# EAGLE design Fluffy-1A (EAGLE 7.7.0)
Assembly variants: production, production2

## Sheet 1 of 2
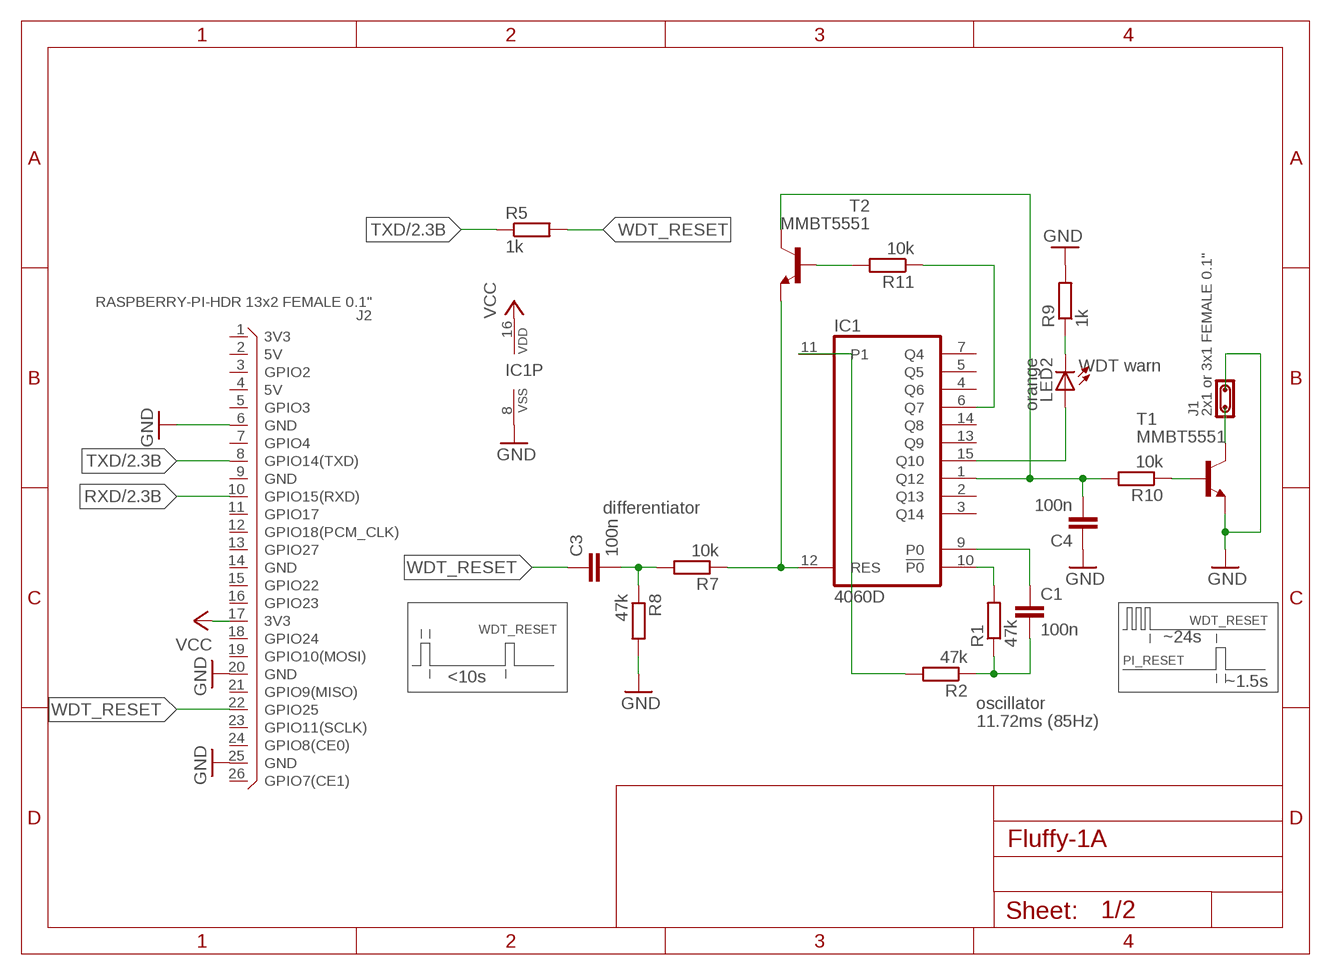
[diagram p0: schematic, sheet 1]

### Parts
C1  100n  C-EUC0805K  [C0805K]
C3  100n  C-EUC0805K  [C0805K]
C4  100n  C-EUC0805K  [C0805K]
IC1  4060D  [SO16]
J1  2x1 or 3x1 FEMALE 0.1"  JP02  [JP02N]
J2  RASPBERRY-PI-HDR 13x2 FEMALE 0.1"  RASPBERRY-PI-HDR  [X26R-DIL]
LED2  orange  LEDCHIPLED_0805  [CHIPLED_0805]
R1  47k  R-EU_R0805  [R0805]
R2  47k  R-EU_R0805  [R0805]
R5  1k  R-EU_R0805  [R0805]  (not fitted in variant production)  (not fitted in variant production2)
R7  10k  R-EU_R0805  [R0805]
R8  47k  R-EU_R0805  [R0805]
R9  1k  R-EU_R0805  [R0805]
R10  10k  R-EU_R0805  [R0805]
R11  10k  R-EU_R0805  [R0805]
T1  MMBT5551  MMBT5551LT1-NPN-SOT23-BEC  [SOT23-BEC]
T2  MMBT5551  MMBT5551LT1-NPN-SOT23-BEC  [SOT23-BEC]

### Nets
GND: C4.1 IC1.8(VSS) J1.2 J2.6(GND) J2.20(GND) J2.25(GND) R8.2 R9.2 T1.E ; also sheet 2
N$4: IC1.10(!P0) R1.2
N$5: C1.1 IC1.9(P0)
N$6: C1.2 R1.1 R2.1
N$7: LED2.C R9.1
N$9: IC1.15(Q10) LED2.A
N$10: IC1.11(P1) R2.2
N$11: C3.2 R7.2 R8.1
N$12: IC1.12(RES) R7.1 T2.E
N$15: R10.1 T1.B
N$16: J1.1 T1.C
N$17: C4.2 IC1.1(Q12) R10.2 T2.C
N$18: R11.2 T2.B
N$19: IC1.6(Q7) R11.1
RXD: J2.10(GPIO15(RXD)) ; also sheet 2
TXD: J2.8(GPIO14(TXD)) R5.1 ; also sheet 2
VCC: IC1.16(VDD) J2.17(3V3) ; also sheet 2
WDT_RESET: C3.1 J2.22(GPIO25) R5.2
Unconnected: IC1.2(Q13) IC1.3(Q14) IC1.4(Q6) IC1.5(Q5) IC1.7(Q4) IC1.13(Q9) IC1.14(Q8) J2.1(3V3) J2.2(5V) J2.3(GPIO2) J2.4(5V) J2.5(GPIO3) J2.7(GPIO4) J2.9(GND) J2.11(GPIO17) J2.12(GPIO18(PCM_CLK)) J2.13(GPIO27) J2.14(GND) J2.15(GPIO22) J2.16(GPIO23) J2.18(GPIO24) J2.19(GPIO10(MOSI)) J2.21(GPIO9(MISO)) J2.23(GPIO11(SCLK)) J2.24(GPIO8(CE0)) J2.26(GPIO7(CE1))

### Notes on the sheet
- WDT warn
- differentiator
- WDT_RESET
- WDT_RESET
- ~24s
- PI_RESET
- <10s | ~1.5s
- oscillator
- 11.72ms (85Hz)

## Sheet 2 of 2
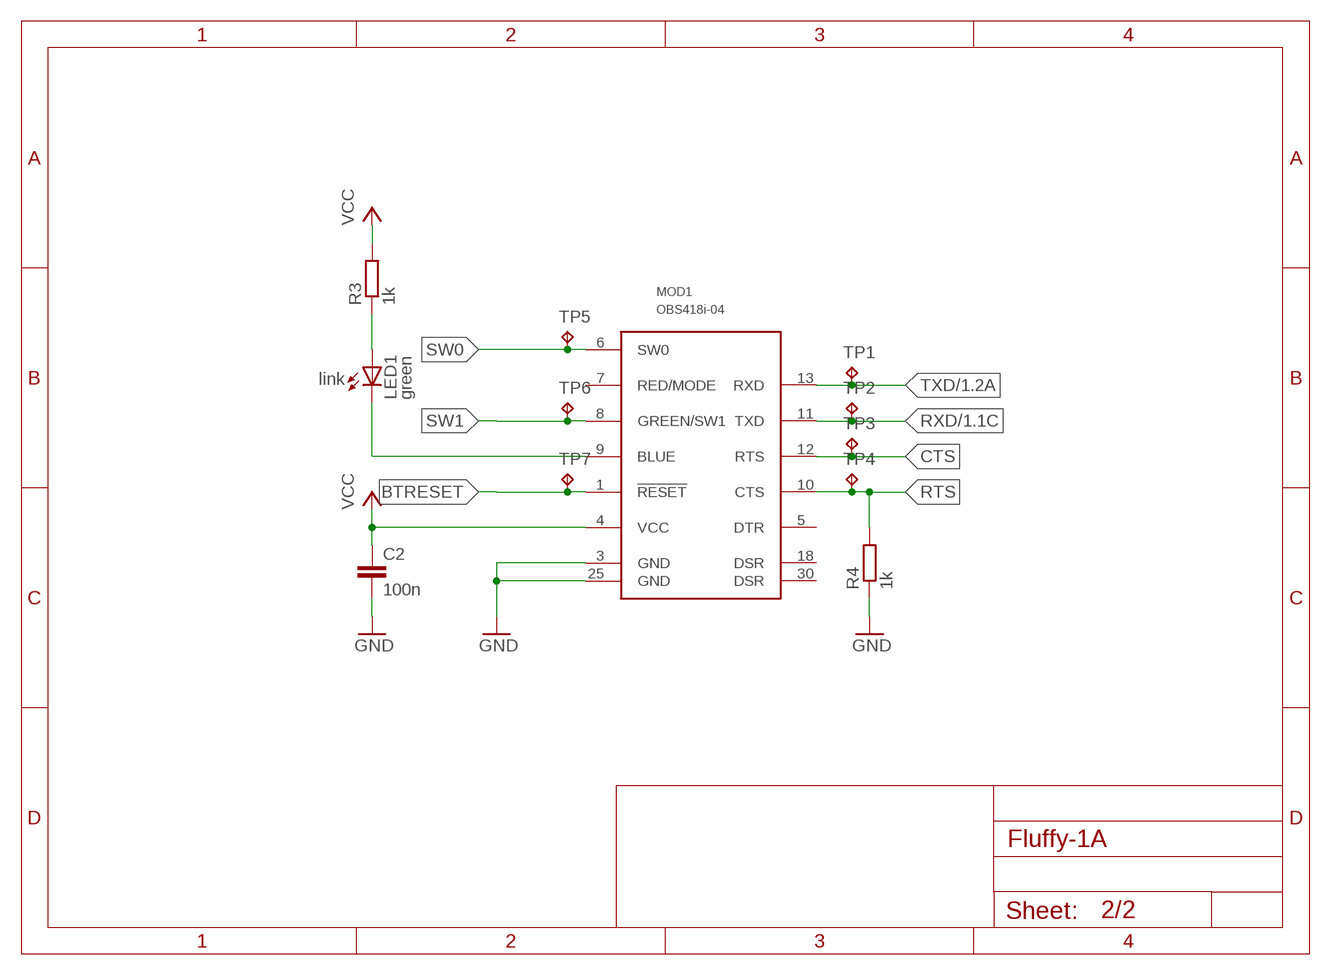
[diagram p1: schematic, sheet 2]

### Parts
C2  100n  C-EUC0805K  [C0805K]
LED1  green  LEDCHIPLED_0805  [CHIPLED_0805]
MOD1  OBS418i-04  OBS421-16-NH  [OBS4X1-NOHOLES]  (not fitted in variant production)  (not fitted in variant production2)
R3  1k  R-EU_R0805  [R0805]
R4  1k  R-EU_R0805  [R0805]
TP1  TPTP10SQ  [TP10SQ]
TP2  TPTP10SQ  [TP10SQ]
TP3  TPTP10SQ  [TP10SQ]
TP4  TPTP10SQ  [TP10SQ]
TP5  TPTP10SQ  [TP10SQ]
TP6  TPTP10SQ  [TP10SQ]
TP7  TPTP10SQ  [TP10SQ]

### Nets
BTRESET: MOD1.1(!RESET) TP7.TP
CTS: MOD1.12(RTS) TP3.TP
GND: C2.2 MOD1.3(GND) MOD1.25(GND) R4.1 ; also sheet 1
N$1: LED1.C MOD1.9(BLUE)
N$2: LED1.A R3.1
RTS: MOD1.10(CTS) R4.2 TP4.TP
RXD: MOD1.11(TXD) TP2.TP ; also sheet 1
SW0: MOD1.6(SW0) TP5.TP
SW1: MOD1.8(GREEN/SW1) TP6.TP
TXD: MOD1.13(RXD) TP1.TP ; also sheet 1
VCC: C2.1 MOD1.4(VCC) R3.2 ; also sheet 1
Unconnected: MOD1.5(DTR) MOD1.7(RED/MODE) MOD1.18(DSR) MOD1.30(DSR)

### Notes on the sheet
- link

## Library data of the parts
C1-C4 = rcl:C-EU: CAPACITOR, European symbol
IC1 = 40xx:4060: 14-stage binary/ripple COUNTER
J1 = connectors:JP02: Jumper 2 pins
J2 = custom-conn:RASPBERRY-PI-HDR: Raspberry Pi Rev.B extension header
LED1 LED2 = led:LED: LED OSRAM: - CHIPLED LG R971, LG N971, LY N971, LG Q971, LY Q971, LO R971, LY R971 LH N974, LH R974 LS Q976, LO Q976, LY Q976 LO Q996 - Hyper CHIPLED LW Q18S LB Q993, LB Q99A, LB R99A - SideLED LS A670, LO A670, LY A670, LG A670, LP A670 LB A673, LV A673, LT A673, LW A673 LH A674 LY A675 LS A676, LA A676, LO A676, LY A676, LW A676 LS A679, LY A679, LG A679 - Hyper Micro SIDELED® LS Y876, LA Y876, LO Y876, LY Y876 LT Y87S - SmartLED LW L88C, LW L88S LB L89C, LB L89S, LG L890 LS L89K, LO L89K, LY L89K LS L896, LA L896, LO L896, LY L896 - TOPLED LS T670, LO T670, LY T670, LG T670, LP T670 LSG T670, LSP T670, LSY T670, LOP T670, LYG T670 LG T671, LOG T671, LSG T671 LB T673, LV T673, LT T673, LW T673 LH T674 LS T676, LA T676, LO T676, LY T676, LB T676, LH T676, LSB T676, LW T676 LB T67C, LV T67C, LT T67C, LS T67K, LO T67K, LY T67K, LW E67C LS E67B, LA E67B, LO E67B, LY E67B, LB E67C, LV E67C, LT E67C LW T67C LS T679, LY T679, LG T679 LS T770, LO T770, LY T770, LG T770, LP T770 LB T773, LV T773, LT T773, LW T773 LH T774 LS E675, LA E675, LY E675, LS T675 LS T776, LA T776, LO T776, LY T776, LB T776 LHGB T686 LT T68C, LB T68C - Hyper Mini TOPLED® LB M676 - Mini TOPLED Santana® LG M470 LS M47K, LO M47K, LY M47K Source: http://www.osram.convergy.de LUXEON: - LUMILED® LXK2-PW12-R00, LXK2-PW12-S00, LXK2-PW14-U00, LXK2-PW14-V00 LXK2-PM12-R00, LXK2-PM12-S00, LXK2-PM14-U00 LXK2-PE12-Q00, LXK2-PE12-R00, LXK2-PE12-S00, LXK2-PE14-T00, LXK2-PE14-U00 LXK2-PB12-K00, LXK2-PB12-L00, LXK2-PB12-M00, LXK2-PB14-N00, LXK2-PB14-P00, LXK2-PB14-Q00 LXK2-PR12-L00, LXK2-PR12-M00, LXK2-PR14-Q00, LXK2-PR14-R00 LXK2-PD12-Q00, LXK2-PD12-R00, LXK2-PD12-S00 LXK2-PH12-R00, LXK2-PH12-S00 LXK2-PL12-P00, LXK2-PL12-Q00, LXK2-PL12-R00 Source: www.luxeon.com KINGBRIGHT: KA-3528ASYC Source: www.kingbright.com
MOD1 = obs411smd:OBS
R1-R5 R7-R11 = rcl:R-EU_: RESISTOR, European symbol
T1 T2 = transistor:*-NPN-: NPN Transistror BF959 corrected 2008.03.06
TP1-TP7 = testpad:TP: Test pad

## Board
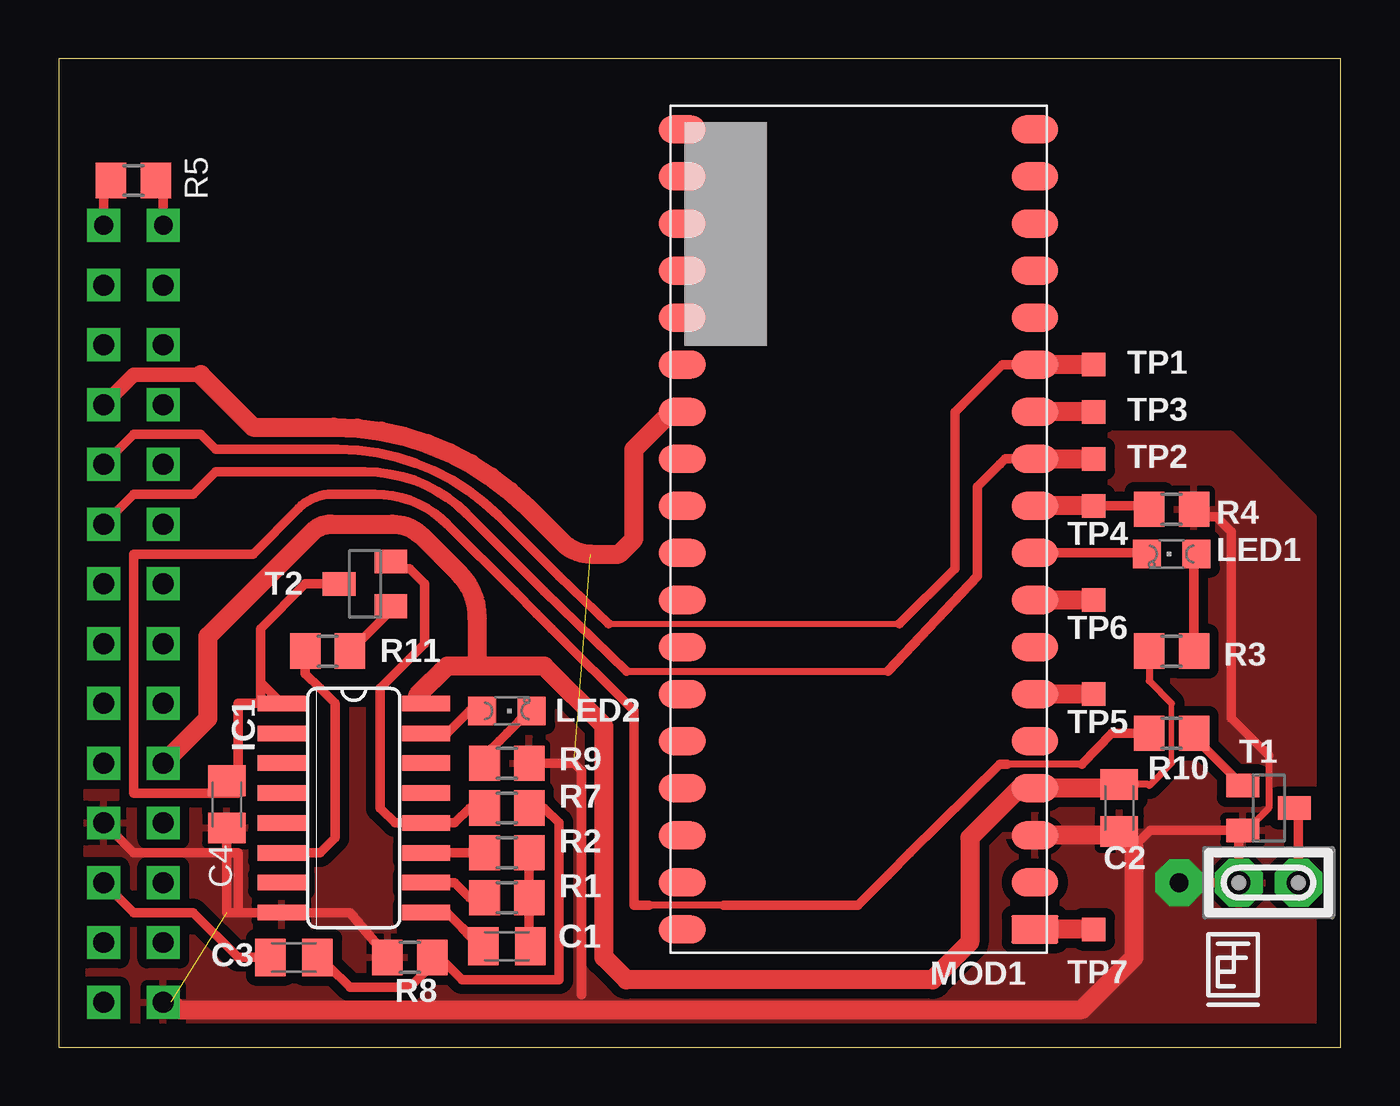
[diagram p2: board, top side]
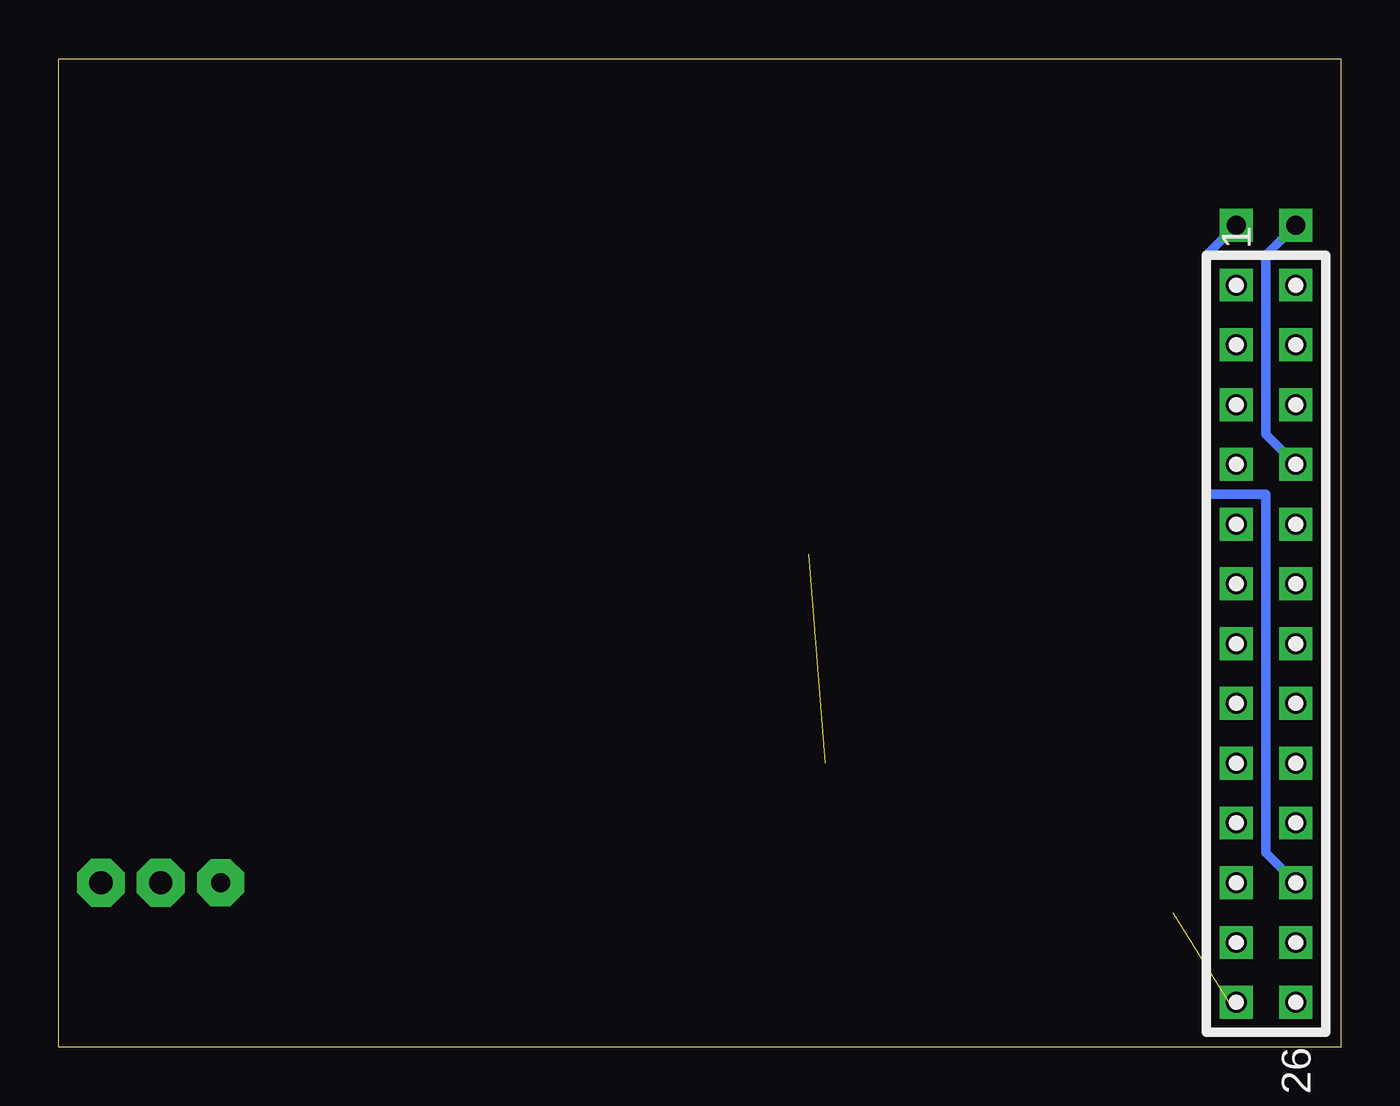
[diagram p3: board, bottom side, seen from below]

Size 54.5 x 42 mm. Coordinates in mm from the lower left corner, seen from the top.
Outline: 0,0 54.5,0 54.5,42 0,42 0,0
Copper layers (1*16): Top 0.035mm / dielectric 1.5mm / Bottom 0.035mm
Design rules "default *": minimum track width 10mil, minimum drill 24mil, track to track 8mil, track to pad 8mil, pad to pad 8mil, via to via 8mil, smd to smd 8mil, copper to edge 40mil, drill to drill 8mil, minimum pad ring 10mil, minimum via ring 8mil, stop-mask expansion 0mil, vias tented up to drill 0mil, thermal gap 10mil

### Footprints (pad centres in the part's own frame; a part is rotated, then mirrored left to right if it is on the bottom)
C0805K = smd 1.3 x 1.6: 1 -1,0; 2 1,0
SO16 = smd 0.66 x 2.032: 1 -4.445,-3.073; 2 -3.175,-3.073; 3 -1.905,-3.073; 4 -0.635,-3.073; 5 0.635,-3.073; 6 1.905,-3.073; 7 3.175,-3.073; 8 4.445,-3.073; 9 4.445,3.073; 10 3.175,3.073; 11 1.905,3.073; 12 0.635,3.073; 13 -0.635,3.073; 14 -1.905,3.073; 15 -3.175,3.073; 16 -4.445,3.073
JP02N = drill 0.991 pad 2.032 octagon: 1 -1.27,0; 2 1.27,0
X26R-DIL = drill 0.889 pad 1.397 square: 1 -15.24,-1.27; 2 -15.24,1.27; 3 -12.7,-1.27; 4 -12.7,1.27; 5 -10.16,-1.27; 6 -10.16,1.27; 7 -7.62,-1.27; 8 -7.62,1.27; 9 -5.08,-1.27; 10 -5.08,1.27; 11 -2.54,-1.27; 12 -2.54,1.27; 13 0,-1.27; 14 0,1.27; 15 2.54,-1.27; 16 2.54,1.27; 17 5.08,-1.27; 18 5.08,1.27; 19 7.62,-1.27; 20 7.62,1.27; 21 10.16,-1.27; 22 10.16,1.27; 23 12.7,-1.27; 24 12.7,1.27; 25 15.24,-1.27; 26 15.24,1.27
CHIPLED_0805 = smd 1.2 x 1.2: A 0,-1.05; C 0,1.05
OBS4X1-NOHOLES = smd 2 x 1.2: 1 7.5,-17; 2 7.5,-15; 3 7.5,-13; 4 7.5,-11; 5 7.5,-9; 6 7.5,-7; 7 7.5,-5; 8 7.5,-3; 9 7.5,-1; 10 7.5,1; 11 7.5,3; 12 7.5,5; 13 7.5,7; 14 7.5,9; 15 7.5,11; 16 7.5,13; 17 7.5,15; 18 7.5,17; 19 -7.5,17; 20 -7.5,15; 21 -7.5,13; 22 -7.5,11; 23 -7.5,9; 24 -7.5,7; 25 -7.5,5; 26 -7.5,3; 27 -7.5,1; 28 -7.5,-1; 29 -7.5,-3; 30 -7.5,-5; 31 -7.5,-7; 32 -7.5,-9; 33 -7.5,-11; 34 -7.5,-13; 35 -7.5,-15; 36 -7.5,-17
R0805 = smd 1.3 x 1.5: 1 -0.95,0; 2 0.95,0
SOT23-BEC = smd 1 x 1.4: B -0.95,-1.1; C 0,1.1; E 0.95,-1.1
TP10SQ = smd 1 x 1: TP 0,0

### Placement (x,y rotation side)
C1  19.05,4.29 0 top
C2  45.09,10.16 270 top
C3  10,3.81 0 top
C4  7.14,10.32 90 top
IC1  12.54,10.16 270 top
J1  51.44,6.99 180 top
J2  3.17,17.14 270 bottom
LED1  47.31,20.95 90 top
LED2  19.05,14.29 270 top
MOD1  34,22 0 top
R1  19.05,6.35 180 top
R2  19.05,8.26 180 top
R3  47.31,16.83 180 top
R4  47.31,22.86 180 top
R5  3.17,36.83 0 top
R7  19.05,10.16 0 top
R8  14.92,3.81 180 top
R9  19.05,12.06 0 top
R10  47.31,13.34 180 top
R11  11.43,16.83 0 top
T1  51.44,10.16 270 top
T2  13.02,19.68 90 top
TP1  44,29 0 top
TP2  44,25 0 top
TP3  44,27 0 top
TP4  44,23 0 top
TP5  44,15 0 top
TP6  44,19 0 top
TP7  44,5 0 top
U$1  [DESIGNER]  48.9,2.22 0 top

### Tracks (layer width: path | path; a pad name or v marks a point on that pad's centre or on a via)
BTRESET
  Top 0.813: TP7.TP MOD1.1
CTS
  Top 0.813: TP3.TP MOD1.12
GND  (via drill 0.8 pad 2)  (2 unrouted)
  Top 0.305: 51.44,12.38 51.44,10.16 50.48,9.21
  Top 0.406: R8.2 12.38,5.71 IC1.8 7.62,5.71 | 7.62,5.71 7.62,8.26 3.17,8.26 J2.20 | T1.E 50.16,9.04 J1.2 v47.62,6.99 | T1.E 46.41,9.21 45.72,8.53 | R4.1 48.58,22.54 49.21,22.54 49.85,21.91 49.85,13.97 51.44,12.38 | 50.48,9.21 T1.E | R9.2 21.91,12.06 22.23,11.75 22.23,2.22 | 7.62,5.71 7.14,5.71 7.14,9.37
  Top 0.61: J2.6 3.17,28.57 6.03,28.57
  Top 0.813: MOD1.3 44.92,9 C2.2 45.72,8.53 45.72,3.81 43.5,1.59 5.08,1.59 4.76,1.91 J2.25 | 6.03,28.57 8.26,26.35 11.69,26.35 arc-45 19.92,22.94 21.41,21.46 arc45 22.62,20.95 23.81,20.95 24.45,21.59 24.45,25.4 26.05,27 MOD1.25
  pour Top (isolate 0.406): 1.27,7.62 1.27,0.64 53.66,0.64 53.66,22.23 49.85,26.04 39.69,26.04 39.05,25.4 39.05,14.29 0.95,14.29 0.95,7.62
N$1
  Top 0.406: LED1.C 46.21,21 MOD1.9
N$2
  Top 0.406: LED1.A 48.26,20.86 R3.1
N$4
  Top 0.406: IC1.10 16.83,6.99 17.46,6.35 R1.2
N$5
  Top 0.406: C1.1 17.89,4.29 17.14,5.08 16.51,5.71 IC1.9
N$6
  Top 0.406: C1.2 20,4.5 R1.1 R2.1
N$7
  Top 0.406: LED2.C 20,14.29 19.05,13.34 18.73,13.02 18.41,12.7 18.41,12.38 R9.1
N$9
  Top 0.406: IC1.15 16.51,13.34 17.46,14.29 LED2.A
N$10
  Top 0.406: R2.2 IC1.11
N$11
  Top 0.406: R7.2 20.64,10.16 21.27,9.53 21.27,3.49 21.27,2.86 17.14,2.86 16.19,3.81 R8.1 15.56,3.5 15.56,3.17 14.92,2.54 12.38,2.54 11.48,3.44 C3.2
N$12
  Top 0.406: R7.1 17.46,10.16 16.83,9.53 IC1.12 14.29,9.53 13.65,10.16 13.65,15.24 15.56,17.14 15.56,19.68 14.92,20.32 13.8,20.32 T2.E
N$15
  Top 0.406: R10.1 48.26,13.19 T1.B
N$16
  Top 0.406: J1.1 52.7,9.99 T1.C
N$17
  Top 0.305: 43.5,12.01 40.32,12.01 | 28.26,6.03 25.08,6.03
  Top 0.406: IC1.1 8.57,15.5 | 8.57,15.5 8.57,17.78 | 8.57,17.78 10.48,19.68 | 10.48,19.68 T2.C 10.48,19.68 | 10.48,19.68 8.57,17.78 | 8.57,17.78 8.57,15.5 | 8.57,15.5 8.57,14.61 7.94,14.61 7.62,14.61 7.62,10.79 | 7.62,10.79 7.3,10.79 3.17,10.79 3.17,20.95 8.26,20.95 10.2,22.9 arc-45 11.64,23.5 13.44,23.5 arc-45 16.51,22.23 19.37,19.37 20.32,18.41 20.95,17.78 24.45,14.29 24.45,6.03 25.08,6.03 | R10.2 44.77,13.34 43.5,12.01 | 40.32,12.01 40.01,12.01 36.2,8.26 35.24,7.3 33.97,6.03 28.26,6.03 | C4.2 7.62,11.32 7.62,10.79
N$18
  Top 0.406: R11.2 14.12,18.57 T2.B
N$19
  Top 0.406: R11.1 10.48,15.88 11.11,15.24 11.75,14.61 11.75,9.53 11.75,8.89 11.11,8.26 IC1.6
RTS
  Top 0.406: R4.2 46.22,23 TP4.TP
  Top 0.813: TP4.TP MOD1.10
RXD
  Top 0.305: 24.13,15.98 35.24,15.98
  Top 0.406: J2.10 3.17,23.5 5.71,23.5 6.67,24.45 13.03,24.45 arc-45 17.34,22.66 20.64,19.37 24.13,15.98 | 35.24,15.98 39.05,20 39.05,23.81 40.01,24.77 40.24,25 MOD1.11
  Top 0.813: MOD1.11 TP2.TP
SW0
  Top 0.813: TP5.TP MOD1.6
SW1
  Top 0.813: TP6.TP MOD1.8
TXD  (via drill 0.8 pad 1.4)
  Top 0.254: 23.37,17.98 35.74,17.98
  Top 0.406: J2.8 3.17,26.04 6.03,26.04 6.67,25.4 11.88,25.4 arc-45 18.7,22.57 21.27,20 23.37,17.98 | 35.74,17.98 38.1,20.32 38.1,26.99 40.11,29 MOD1.13 | v1.91,34.92 1.91,36.51 R5.1
  Top 0.813: TP1.TP MOD1.13
  Bottom 0.406: J2.8 3.17,26.04 3.17,33.66 2.54,34.29 v1.91,34.92
VCC
  Top 0.229: 47.31,14.61 47.31,12.06
  Top 0.305: R3.2 46.35,15.56 47.31,14.61 | 47.31,12.06 46.35,11.11 46.31,11.16 C2.1
  Top 0.406: 15.24,14.92 15.24,14.71 IC1.16
  Top 0.813: C2.1 44.92,11 MOD1.4 40.84,11 38.73,8.89 38.73,4.45 37.15,2.86 24.13,2.86 23.18,3.81 23.18,13.65 20.64,16.19 17.78,16.19 | J2.17 6.35,13.97 6.35,17.46 10.78,21.89 arc-45 11.59,22.23 14.18,22.23 arc-45 15.45,21.7 16.99,20.16 arc-45 17.78,18.24 17.78,16.19 | 17.78,16.19 16.51,16.19 15.24,14.92
WDT_RESET  (via drill 0.8 pad 1.4)
  Top 0.406: C3.1 7.62,3.81 5.71,5.71 3.17,5.71 J2.22 | v4.45,34.92 4.45,36.51 R5.2
  Bottom 0.406: J2.22 3.17,8.26 3.17,23.5 5.71,23.5 5.71,33.66 v4.45,34.92

### Text on the board
tValues: A | A
Document: NO SILKSCREEN ON SOLDER SIDE!
tDocu: 1 | 25